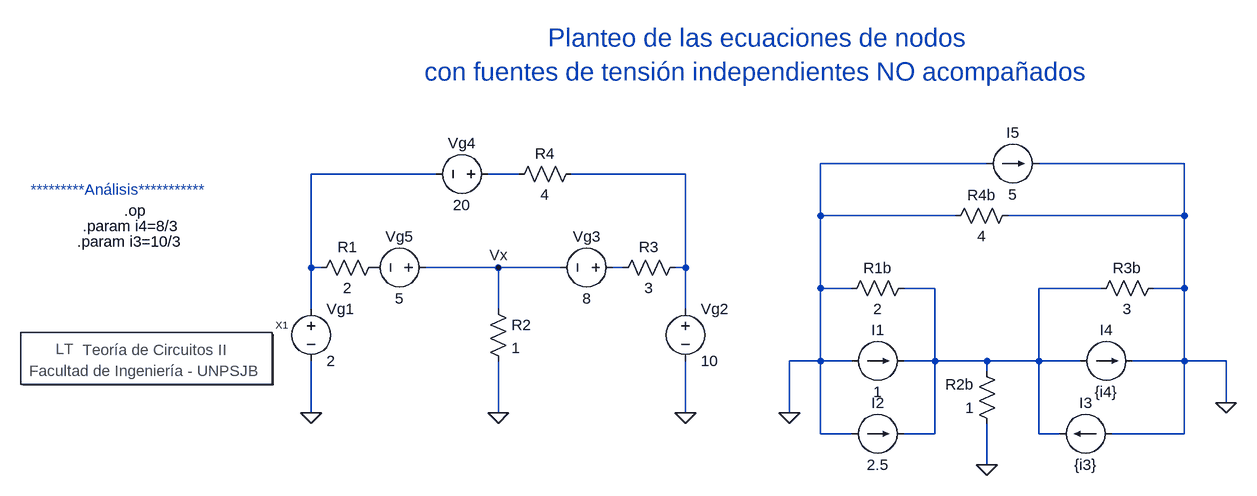
[diagram p0: schematic fuentes_acompañadas_nodos_01.asc]
fuentes_acompañadas_nodos_01.asc, the LTspice schematic file:
Version 4
SHEET 1 1300 680
WIRE 912 96 656 96
WIRE 1216 96 992 96
WIRE 64 112 -128 112
WIRE 192 112 144 112
WIRE 448 112 272 112
WIRE 656 176 656 96
WIRE 864 176 656 176
WIRE 1216 176 1216 96
WIRE 1216 176 944 176
WIRE -128 256 -128 112
WIRE -112 256 -128 256
WIRE 160 256 48 256
WIRE 256 256 160 256
WIRE 352 256 336 256
WIRE 448 256 448 112
WIRE 448 256 432 256
WIRE 656 288 656 176
WIRE 704 288 656 288
WIRE 832 288 784 288
WIRE 1088 288 992 288
WIRE 1216 288 1216 176
WIRE 1216 288 1168 288
WIRE -128 320 -128 256
WIRE 160 320 160 256
WIRE 448 320 448 256
WIRE 656 400 656 288
WIRE 656 400 608 400
WIRE 704 400 656 400
WIRE 832 400 832 288
WIRE 832 400 784 400
WIRE 912 400 832 400
WIRE 992 400 992 288
WIRE 992 400 912 400
WIRE 1056 400 992 400
WIRE 1216 400 1216 288
WIRE 1216 400 1136 400
WIRE 1280 400 1216 400
WIRE 912 416 912 400
WIRE 1280 464 1280 400
WIRE -128 480 -128 400
WIRE 160 480 160 400
WIRE 448 480 448 400
WIRE 608 480 608 400
WIRE 656 512 656 400
WIRE 704 512 656 512
WIRE 832 512 832 400
WIRE 832 512 784 512
WIRE 992 512 992 400
WIRE 1024 512 992 512
WIRE 1216 512 1216 400
WIRE 1216 512 1104 512
WIRE 912 560 912 496
FLAG -128 480 0
FLAG 160 480 0
FLAG 448 480 0
FLAG 160 256 Vx
FLAG 608 480 0
FLAG 912 560 0
FLAG 1280 464 0
DATAFLAG -128 256 ""
DATAFLAG 176 112 ""
DATAFLAG 448 256 ""
DATAFLAG 160 256 ""
DATAFLAG 912 400 ""
SYMBOL voltage 160 112 R90
WINDOW 0 -32 56 VBottom 2
WINDOW 3 32 56 VTop 2
SYMATTR InstName Vg4
SYMATTR Value 20
SYMBOL res 288 96 R90
WINDOW 0 0 56 VBottom 2
WINDOW 3 32 56 VTop 2
SYMATTR InstName R4
SYMATTR Value 4
SYMBOL voltage 64 256 R90
WINDOW 0 -32 56 VBottom 2
WINDOW 3 32 56 VTop 2
SYMATTR InstName Vg5
SYMATTR Value 5
SYMBOL res -16 240 R90
WINDOW 0 0 56 VBottom 2
WINDOW 3 32 56 VTop 2
SYMATTR InstName R1
SYMATTR Value 2
SYMBOL voltage 352 256 R90
WINDOW 0 -32 56 VBottom 2
WINDOW 3 32 56 VTop 2
SYMATTR InstName Vg3
SYMATTR Value 8
SYMBOL res 448 240 R90
WINDOW 0 0 56 VBottom 2
WINDOW 3 32 56 VTop 2
SYMATTR InstName R3
SYMATTR Value 3
SYMBOL voltage -128 304 R0
SYMATTR InstName Vg1
SYMATTR Value 2
SYMBOL res 144 304 R0
SYMATTR InstName R2
SYMATTR Value 1
SYMBOL voltage 448 304 R0
SYMATTR InstName Vg2
SYMATTR Value 10
SYMBOL Circuitos2\\Letreros\\Teoría\ de\ Circuitos\ II -384 400 R0
SYMATTR InstName X1
SYMBOL res 800 272 R90
WINDOW 0 0 56 VBottom 2
WINDOW 3 32 56 VTop 2
SYMATTR InstName R1b
SYMATTR Value 2
SYMBOL current 704 400 R270
WINDOW 0 32 40 VTop 2
WINDOW 3 -32 40 VBottom 2
SYMATTR InstName I1
SYMATTR Value 1
SYMBOL current 704 512 R270
WINDOW 0 32 40 VTop 2
WINDOW 3 -32 40 VBottom 2
SYMATTR InstName I2
SYMATTR Value 2.5
SYMBOL res 960 160 R90
WINDOW 0 0 56 VBottom 2
WINDOW 3 32 56 VTop 2
SYMATTR InstName R4b
SYMATTR Value 4
SYMBOL res 928 512 R180
WINDOW 0 36 76 Left 2
WINDOW 3 36 40 Left 2
SYMATTR InstName R2b
SYMATTR Value 1
SYMBOL current 1104 512 R90
WINDOW 0 -32 40 VBottom 2
WINDOW 3 32 40 VTop 2
SYMATTR InstName I3
SYMATTR Value {i3}
SYMBOL current 1056 400 R270
WINDOW 0 32 40 VTop 2
WINDOW 3 -32 40 VBottom 2
SYMATTR InstName I4
SYMATTR Value {i4}
SYMBOL res 1184 272 R90
WINDOW 0 0 56 VBottom 2
WINDOW 3 32 56 VTop 2
SYMATTR InstName R3b
SYMATTR Value 3
SYMBOL current 912 96 R270
WINDOW 0 32 40 VTop 2
WINDOW 3 -32 40 VBottom 2
SYMATTR InstName I5
SYMATTR Value 5
TEXT -416 168 Left 2 !.op
TEXT -560 136 Left 2 ;*********Análisis***********
TEXT 560 -72 Center 4 ;Planteo de las ecuaciones de nodos\ncon fuentes de tensión independientes NO acompañados
TEXT -480 192 Left 2 !.param i4=8/3
TEXT -488 216 Left 2 !.param i3=10/3

The netlist it stands for:
* fuentes_acompañadas_nodos_01.asc
Vg4 N002 N001 20
R4 N003 N002 4
Vg5 Vx P001 5
R1 P001 N001 2
Vg3 N004 Vx 8
R3 N003 N004 3
Vg1 N001 0 2
R2 Vx 0 1
Vg2 N003 0 10
XX1 Teoría de Circuitos II
R1b N005 0 2
I1 0 N005 1
I2 0 N005 2.5
R4b 0 0 4
R2b 0 N005 1
I3 0 N005 {i3}
I4 N005 0 {i4}
R3b 0 N005 3
I5 0 0 5
.op
* *********Análisis***********
* Planteo de las ecuaciones de nodos
* con fuentes de tensión independientes NO acompañados
.param i4=8/3
.param i3=10/3
.backanno
.end